# Altium schematic sheet PICKIT2.SchDoc
size 254 x 127 mm; SheetNumber: 0; SheetTotal: 0
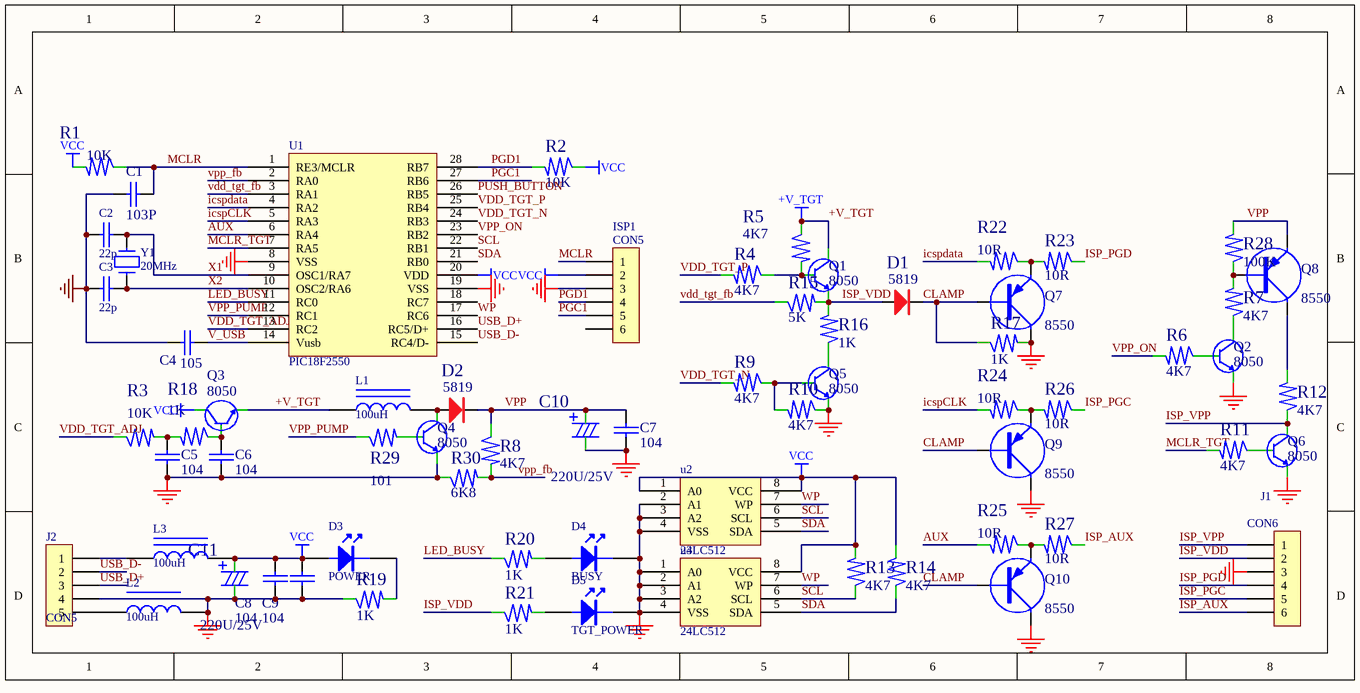
[diagram p0: PICKIT2.SchDoc]

## Parts
C1  103P  [0603]
C2  22p  [0603]
C3  22p  [0603]
C4  105  [0603]
C5  104  [0603]
C6  104  [0603]
C7  104  [0603]
C8  104  [0603]
C9  104  [0603]
C10  220U/25V  [3528]
C11  220U/25V  [3528]
D1  5819  [MLL34]
D2  5819  [MLL34]
D3  POWER  [0805-LED]
D4  BUSY  [0805-LED]
D5  TGT_POWER  [0805-LED]
ISP1  CON5  [SIP5]
J1  CON6  [SIP6]
J2  CON5  [sip5]
L1  100uH  [rb.2/.4]
L2  100uH  [0805]
L3  100uH  [0805]
Q1  8050  [SOT-23]
Q2  8050  [SOT-23]
Q3  8050  [SOT-23]
Q4  8050  [SOT-23]
Q5  8050  [SOT-23]
Q6  8050  [SOT-23]
Q7  8550  [SOT-23]
Q8  8550  [SOT-23]
Q9  8550  [SOT-23]
Q10  8550  [SOT-23]
R1  10K  [0603]
R2  10K  [0603]
R3  10K  [0603]
R4  4K7  [0603]
R5  4K7  [0603]
R6  4K7  [0603]
R7  4K7  [0603]
R8  4K7  [0603]
R9  4K7  [0603]
R10  4K7  [0603]
R11  4K7  [0603]
R12  4K7  [0603]
R13  4K7  [0603]
R14  4K7  [0603]
R15  5K  [0603]
R16  1K  [0603]
R17  1K  [0603]
R18  1K  [0603]
R19  1K  [0603]
R20  1K  [0603]
R21  1K  [0603]
R22  10R  [0603]
R23  10R  [0603]
R24  10R  [0603]
R25  10R  [0603]
R26  10R  [0603]
R27  10R  [0603]
R28  100K  [0603]
R29  101  [0603]
R30  6K8  [0603]
U1  PIC18F2550  [sol-28]
u2  24LC512  [SO-8]
u3  24LC512  [SO-8]
Y1  20MHz  [smd5032]

## Nets
+V_TGT: L1.1 Q1.C Q3.E R5.1
GND: C1.1 C2.2 C3.1 C4.2 C5.1 C6.1 C7.1 C8.2 C9.2 C10.2 C11.2 D4.K D5.K ISP1.3 J1.3 J2.4 L2.2 Q2.E Q4.E Q5.E Q6.E Q7.C Q9.C Q10.C R10.1 R17.2 R19.1 R30.1 U1.8(VSS) U1.19(VSS) u2.2(A1) u2.3(A2) u2.4(VSS) u3.1(A0) u3.2(A1) u3.3(A2) u3.4(VSS)
VCC: C8.1 C9.1 C11.1 D3.A ISP1.2 L3.2 Q3.C R1.2 R2.1 R13.2 R14.2 U1.20(VDD) u2.1(A0) u2.8(VCC) u3.8(VCC)
AUX: R25.2 U1.6(RA4)
CLAMP: D1.K Q7.B Q9.B Q10.B R17.1
icspCLK: R24.2 U1.5(RA3)
icspdata: R22.2 U1.4(RA2)
ISP_AUX: J1.6 R27.1
ISP_PGC: J1.5 R26.1
ISP_PGD: J1.4 R23.1
ISP_VDD: D1.A J1.2 Q1.E R15.2 R16.2 R21.1
ISP_VPP: J1.1 Q6.C R12.1
LED_BUSY: R20.1 U1.11(RC0)
MCLR: C1.2 ISP1.1 R1.1 U1.1(RE3/MCLR)
MCLR_TGT: R11.2 U1.7(RA5)
PGC1: ISP1.5 U1.27(RB6)
PGD1: ISP1.4 R2.2 U1.28(RB7)
PUSH_BUTTON: U1.26(RB5)
SCL: R13.1 U1.22(RB1) u2.6(SCL) u3.6(SCL)
SDA: R14.1 U1.21(RB0) u2.5(SDA) u3.5(SDA)
USB_D+: J2.3 U1.16(RC5/D+)
USB_D-: J2.2 U1.15(RC4/D-)
V_USB: C4.1 U1.14(Vusb)
VDD_TGT_ADJ: R3.1 U1.13(RC2)
vdd_tgt_fb: R15.1 U1.3(RA1)
VDD_TGT_N: R9.2 U1.24(RB3)
VDD_TGT_P: R4.2 U1.25(RB4)
VPP: C7.2 C10.1 D2.K Q8.E R8.1 R28.2
vpp_fb: R8.2 R30.2 U1.2(RA0)
VPP_ON: R6.2 U1.23(RB2)
VPP_PUMP: R29.1 U1.12(RC1)
WP: U1.17(RC6) u2.7(WP) u3.7(WP)
X1: C2.1 U1.9(OSC1/RA7) Y1.1
X2: C3.2 U1.10(OSC2/RA6) Y1.2
NetC5_2: C5.2 R3.2 R18.2
NetC6_2: C6.2 Q3.B R18.1
NetD2_A: D2.A L1.2 Q4.C
NetD3_K: D3.K R19.2
NetD4_A: D4.A R20.2
NetD5_A: D5.A R21.2
NetJ2_1: J2.1 L3.1
NetJ2_5: J2.5 L2.1
NetQ1_B: Q1.B R4.1 R5.2
NetQ2_B: Q2.B R6.1
NetQ2_C: Q2.C R7.1
NetQ4_B: Q4.B R29.2
NetQ5_B: Q5.B R9.1 R10.2
NetQ5_C: Q5.C R16.1
NetQ6_B: Q6.B R11.1
NetQ7_E: Q7.E R22.1 R23.2
NetQ8_B: Q8.B R7.2 R28.1
NetQ8_C: Q8.C R12.2
NetQ9_E: Q9.E R24.1 R26.2
NetQ10_E: Q10.E R25.1 R27.2

Not connected (* = marked no-connect by the designer): ISP1 6; U1 18(RC7)

## Library data of the parts
C1 C4-C9 = CAP
C2 C3 = CAP: C; Part Field 1: 0; Part Field 10: 10u; Part Field 2: 0; Part Field 3: 0; Part Field 4: 0; Part Field 5: 1; Part Field 6: 0; Part Field 7: 10n; Part Field 8: 10n; Part Field 9: 5u
C10 C11 = +CAP: ELECTROLYTIC CAPACITOR
D1 D2 = DIODE
D3-D5 = LED
ISP1 J1 = CON6: Connector
J2 = CON5: Connector
L1-L3 = INDUCTOR IRON
Q1-Q6 = NPN: NPN TRANSISTOR
Q7-Q10 = PNP
R1-R30 = RES: RESISTOR
Y1 = CRYSTAL: Q; Part Field 1: 0; Part Field 10: 10u; Part Field 2: 0; Part Field 3: 0; Part Field 4: 0; Part Field 5: 1; Part Field 6: 0; Part Field 7: 10n; Part Field 8: 10n; Part Field 9: 5u